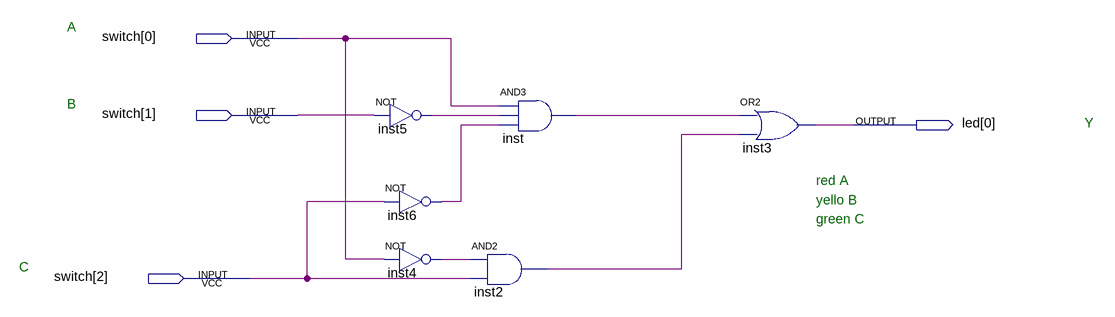
[diagram p0: schematic sheet]
// Quartus schematic pj305.bdf as structural Verilog: 6 symbols, 4 pins
module pj305 (
  input  [2:0] switch,
  output [0:0] led
);

  wire inst2_out, inst4_out, inst5_out, inst6_out, inst_out;

  not inst5 (inst5_out, switch[1]);
  not inst6 (inst6_out, switch[2]);
  not inst4 (inst4_out, switch[0]);
  and inst (inst_out, switch[0], inst5_out, inst6_out);
  and inst2 (inst2_out, inst4_out, switch[2]);
  or inst3 (led[0], inst_out, inst2_out);

  // Notes on the sheet:
  //   A
  //   B
  //   Y
  //   red A
  //   yello B
  //   green C
  //   C
endmodule
